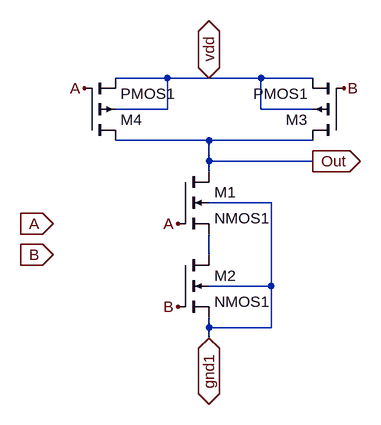
[diagram p0: schematic NAND.asc]
NAND.asc, the LTspice schematic file:
Version 4.1
SHEET 1 880 680
WIRE 176 0 96 0
WIRE 240 0 176 0
WIRE 320 0 240 0
WIRE 400 0 320 0
WIRE 176 48 176 0
WIRE 176 48 96 48
WIRE 320 48 320 0
WIRE 400 48 320 48
WIRE 240 96 96 96
WIRE 400 96 240 96
WIRE 240 128 240 96
WIRE 400 128 240 128
WIRE 240 144 240 128
WIRE 336 192 240 192
WIRE 240 272 240 240
WIRE 336 320 336 192
WIRE 336 320 240 320
WIRE 240 384 240 368
WIRE 336 384 336 320
WIRE 336 384 240 384
WIRE 240 400 240 384
FLAG 0 224 A
IOPIN 0 224 In
FLAG 0 272 B
IOPIN 0 272 In
FLAG 400 128 Out
IOPIN 400 128 Out
FLAG 240 400 gnd1
IOPIN 240 400 BiDir
FLAG 240 0 vdd
IOPIN 240 0 BiDir
FLAG 48 16 A
FLAG 192 224 A
FLAG 192 352 B
FLAG 448 16 B
SYMBOL nmos4 192 144 R0
SYMATTR InstName M1
SYMATTR Value2 l=1u w=2u
SYMATTR Value NMOS1
SYMBOL nmos4 192 272 R0
SYMATTR InstName M2
SYMATTR Value2 l=1u w=2u
SYMATTR Value NMOS1
SYMBOL pmos4 448 96 R180
SYMATTR InstName M3
SYMATTR Value2 l=1u w=2u
SYMATTR Value PMOS1
SYMBOL pmos4 48 96 M180
SYMATTR InstName M4
SYMATTR Value2 l=1u w=2u
SYMATTR Value PMOS1

The netlist it stands for:
* NAND.asc
M1 Out A N001 gnd1 NMOS1 l=1u w=2u
M2 N001 B gnd1 gnd1 NMOS1 l=1u w=2u
M3 Out B vdd vdd PMOS1 l=1u w=2u
M4 Out A vdd vdd PMOS1 l=1u w=2u
.model NMOS NMOS
.model PMOS PMOS
.lib standard.mos
.backanno
.end